# Altium schematic sheet ui_main.SchDoc: mcHF Pro Transceiver UI board
size A3; Author: Krassi Atanassov; CompanyName: MØNKA; Engineer: For radio amateurs experimentation, non-commercial use only. Thank you!; Revision: 0.8.5; SheetTotal: 13
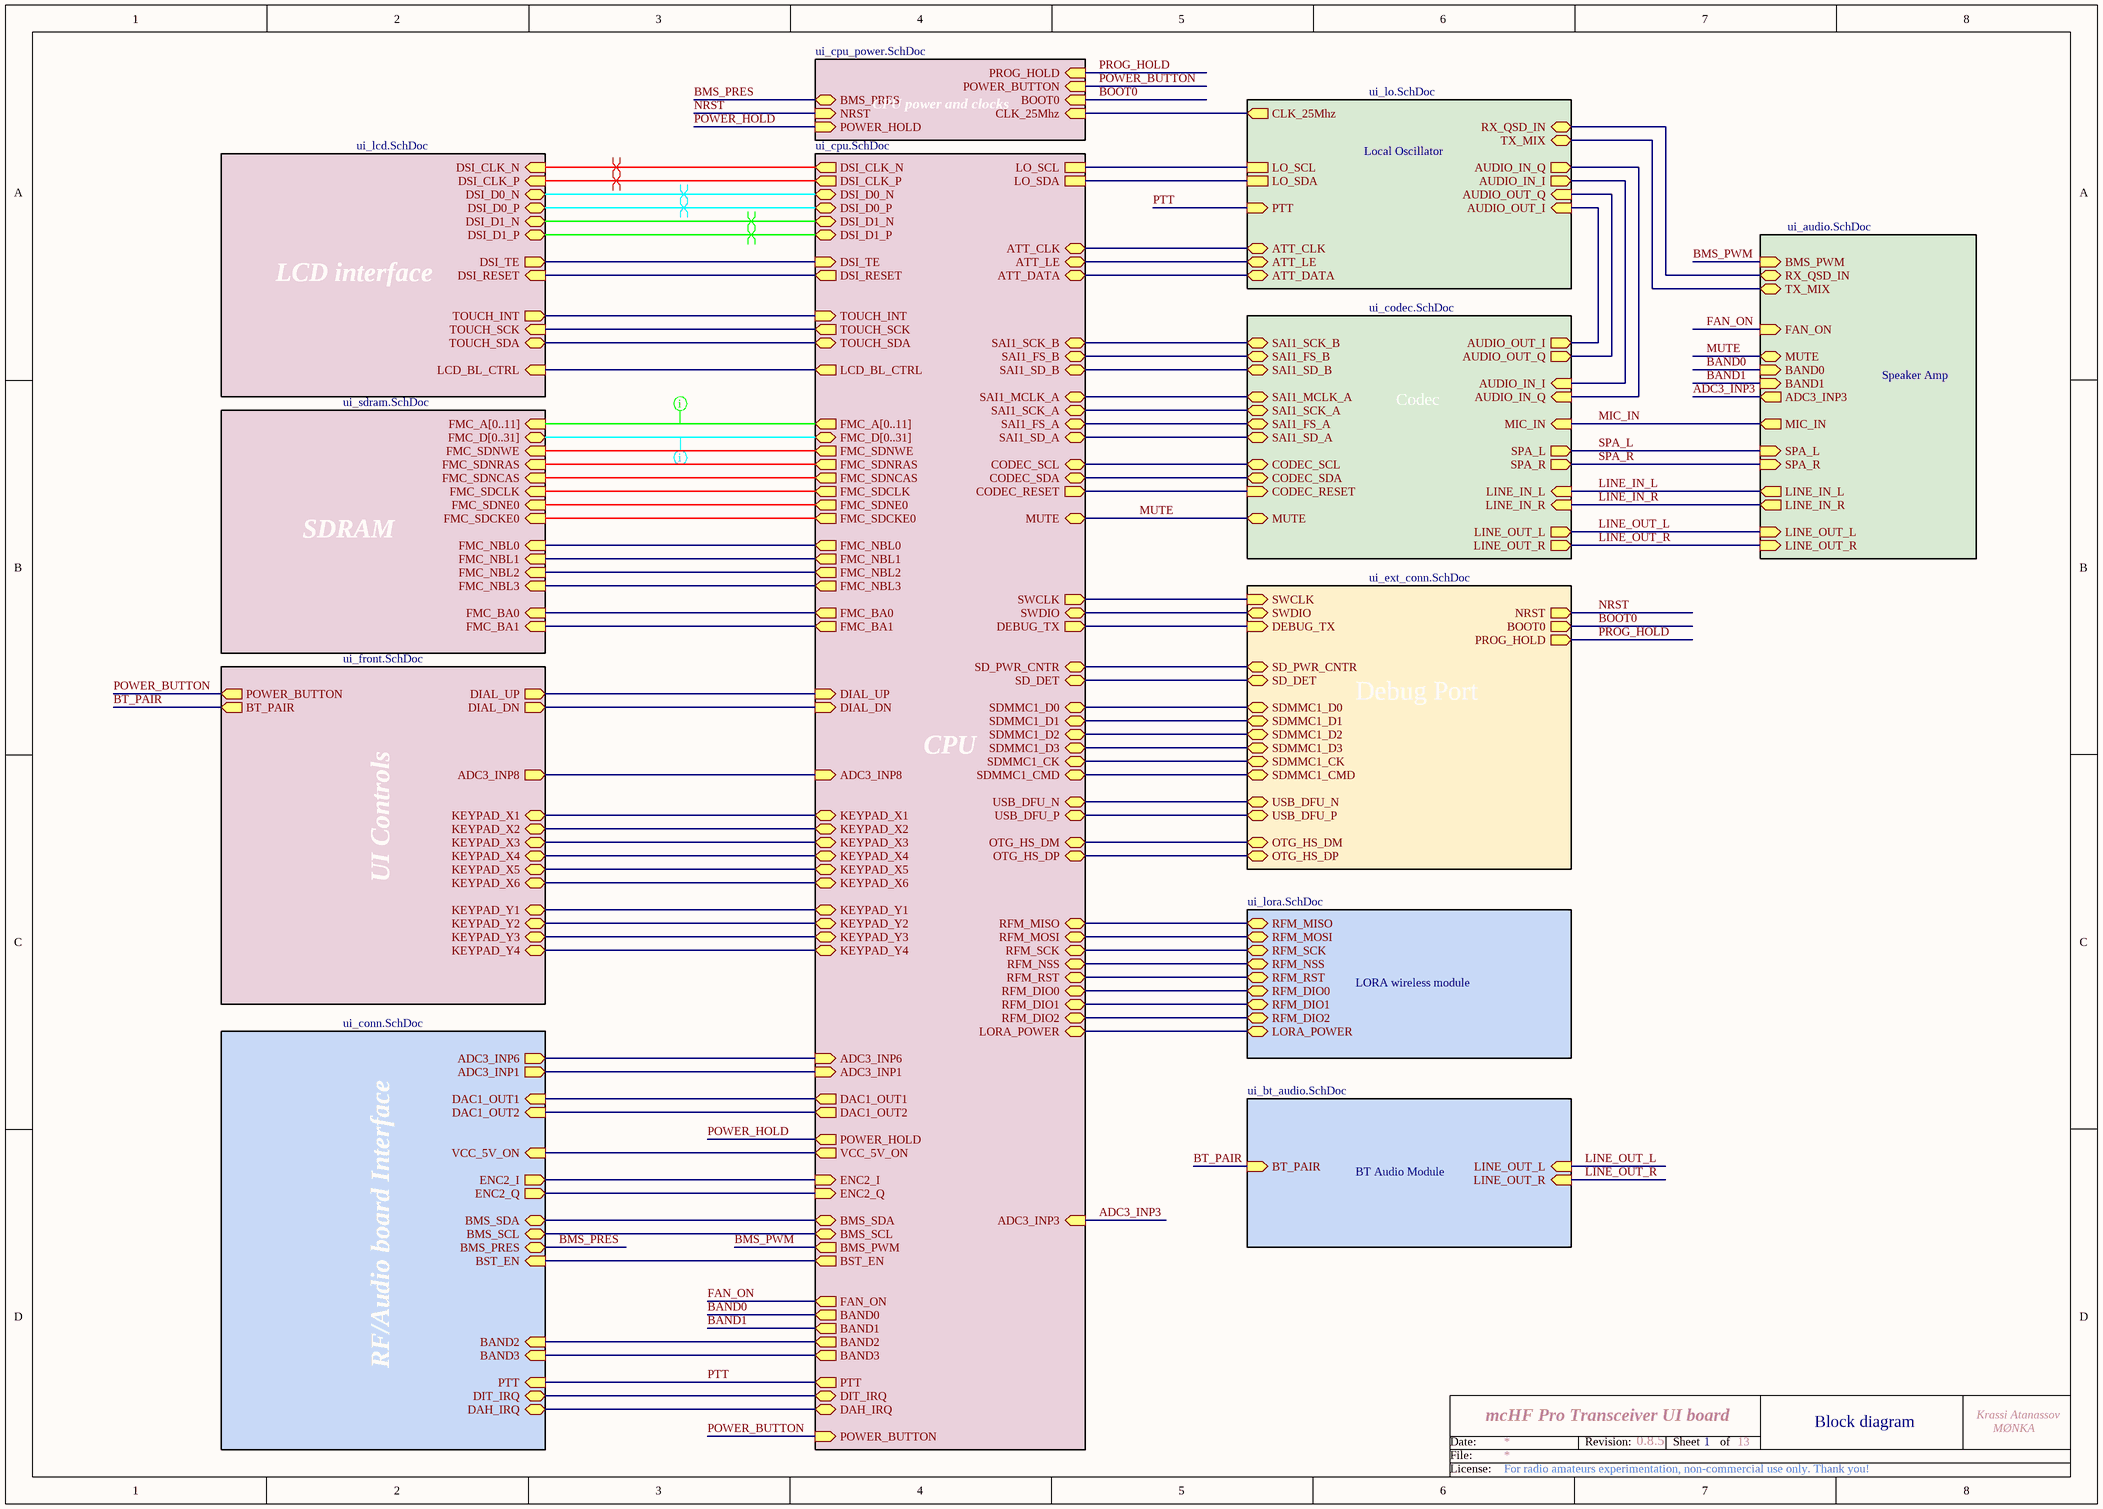
[diagram p0: ui_main.SchDoc]

## Sub-sheets
BT Audio Module = ui_bt_audio.SchDoc: BT_PAIR (in), LINE_OUT_L (in), LINE_OUT_R (in)
Codec = ui_codec.SchDoc: CODEC_SCL (bidir), CODEC_RESET (in), CODEC_SDA (bidir), AUDIO_OUT_I (out), AUDIO_OUT_Q (out), AUDIO_IN_I (in), AUDIO_IN_Q (in), MIC_IN (in), SPA_L (out), MUTE (bidir), LINE_IN_L (in), LINE_IN_R (in), LINE_OUT_L (out), LINE_OUT_R (out), SPA_R (out), SAI1_SCK_B (bidir), SAI1_FS_B (bidir), SAI1_SD_B (bidir), SAI1_MCLK_A (bidir), SAI1_SCK_A (bidir), SAI1_FS_A (bidir), SAI1_SD_A (bidir)
CPU = ui_cpu.SchDoc: FMC_A[0..11] (out), FMC_D[0..31] (bidir), FMC_SDNWE (out), FMC_SDNRAS (out), FMC_SDNCAS (out), FMC_SDCLK (out), FMC_BA0 (out), FMC_BA1 (out), FMC_SDNE0 (out), FMC_SDCKE0 (out), FMC_NBL0 (out), FMC_NBL1 (out), DIAL_UP (in), DIAL_DN (in), FMC_NBL2 (out), FMC_NBL3 (out), SWCLK (out), SWDIO (bidir), SDMMC1_D0 (bidir), SDMMC1_D1 (bidir), SDMMC1_D2 (bidir), SDMMC1_D3 (bidir), SDMMC1_CK (bidir), SDMMC1_CMD (bidir), RFM_DIO0 (bidir), RFM_DIO1 (bidir), RFM_DIO2 (bidir), LORA_POWER (bidir), DSI_CLK_N (out), DSI_CLK_P (out), DSI_D0_N (bidir), DSI_D0_P (bidir), DSI_D1_N (bidir), DSI_D1_P (bidir), LCD_BL_CTRL (out), TOUCH_INT (in), TOUCH_SCK (out), TOUCH_SDA (bidir), DSI_TE (in), DSI_RESET (out), LO_SCL, LO_SDA, KEYPAD_X2 (bidir), KEYPAD_X4 (bidir), KEYPAD_X3 (bidir), KEYPAD_X5 (bidir), KEYPAD_X6 (bidir), KEYPAD_Y1 (bidir), KEYPAD_Y2 (bidir), KEYPAD_Y3 (bidir), ADC3_INP6 (in), KEYPAD_Y4 (bidir), ADC3_INP1 (in), POWER_HOLD (out), DAC1_OUT1 (out), DAC1_OUT2 (out), KEYPAD_X1 (bidir), CODEC_SCL (bidir), CODEC_SDA (bidir), SAI1_SCK_B (bidir), SAI1_FS_B (bidir), SAI1_SD_B (bidir), SAI1_MCLK_A (bidir), SAI1_SCK_A (bidir), SAI1_FS_A (bidir), SAI1_SD_A (bidir), DEBUG_TX (out), VCC_5V_ON (out), RFM_MISO (bidir), RFM_MOSI (bidir), RFM_NSS (bidir), BAND0 (out), BAND1 (out), BAND2 (out), BAND3 (out), PTT (out), DIT_IRQ (bidir), DAH_IRQ (bidir), ADC3_INP8 (in), USB_DFU_N (bidir), USB_DFU_P (bidir), CODEC_RESET (out), POWER_BUTTON (in), MUTE (bidir), RFM_SCK (bidir), SD_DET (bidir), SD_PWR_CNTR (bidir), OTG_HS_DM (bidir), OTG_HS_DP (bidir), RFM_RST (bidir), BMS_SDA (bidir), BMS_SCL (bidir), ENC2_I (in), ENC2_Q (in), FAN_ON (out), ATT_CLK (bidir), ATT_LE (bidir), ATT_DATA (bidir), ADC3_INP3 (in), BMS_PWM (out), BST_EN (out)
CPU power and clocks = ui_cpu_power.SchDoc: NRST (in), CLK_25Mhz (in), POWER_HOLD (in), POWER_BUTTON (in), BOOT0 (in), BMS_PRES (bidir), PROG_HOLD (in)
Debug Port = ui_ext_conn.SchDoc: SWCLK (in), SWDIO (bidir), NRST (out), SD_PWR_CNTR (bidir), SD_DET (bidir), DEBUG_TX (in), USB_DFU_N (bidir), USB_DFU_P (bidir), SDMMC1_D0 (bidir), SDMMC1_D1 (bidir), SDMMC1_D2 (bidir), SDMMC1_D3 (bidir), SDMMC1_CK (bidir), SDMMC1_CMD (bidir), OTG_HS_DM (bidir), OTG_HS_DP (bidir), BOOT0 (out), PROG_HOLD (out)
LCD interface = ui_lcd.SchDoc: DSI_CLK_N (in), LCD_BL_CTRL (in), TOUCH_INT (out), TOUCH_SCK (in), TOUCH_SDA (bidir), DSI_CLK_P (in), DSI_D0_N (bidir), DSI_D0_P (bidir), DSI_D1_N (bidir), DSI_D1_P (bidir), DSI_TE (out), DSI_RESET (in)
Local Oscillator = ui_lo.SchDoc: LO_SCL, LO_SDA, CLK_25Mhz (out), AUDIO_OUT_I (in), AUDIO_OUT_Q (in), AUDIO_IN_I (out), AUDIO_IN_Q (out), TX_MIX (bidir), RX_QSD_IN (bidir), PTT (in), ATT_CLK (bidir), ATT_LE (bidir), ATT_DATA (bidir)
LORA wireless module = ui_lora.SchDoc: RFM_MISO (bidir), RFM_MOSI (bidir), RFM_SCK (bidir), RFM_NSS (bidir), RFM_RST (bidir), RFM_DIO0 (bidir), LORA_POWER (bidir), RFM_DIO1 (bidir), RFM_DIO2 (bidir)
RF/Audio board Interface = ui_conn.SchDoc: ADC3_INP6 (out), ADC3_INP1 (out), DAC1_OUT1 (in), DAC1_OUT2 (in), VCC_5V_ON (in), BAND2 (in), BAND3 (in), PTT (in), DIT_IRQ (bidir), DAH_IRQ (bidir), BMS_SDA (bidir), BMS_SCL (bidir), BMS_PRES (bidir), ENC2_I (out), ENC2_Q (out), BST_EN (in)
SDRAM = ui_sdram.SchDoc: FMC_A[0..11] (in), FMC_D[0..31] (bidir), FMC_SDNWE (in), FMC_SDNRAS (in), FMC_SDNCAS (in), FMC_SDCLK (in), FMC_BA0 (in), FMC_BA1 (in), FMC_NBL0 (in), FMC_NBL1 (in), FMC_SDNE0 (in), FMC_SDCKE0 (in), FMC_NBL2 (in), FMC_NBL3 (in)
Speaker Amp = ui_audio.SchDoc: MIC_IN (out), SPA_L (in), MUTE (bidir), LINE_IN_L (out), LINE_IN_R (out), LINE_OUT_L (in), LINE_OUT_R (in), SPA_R (in), BMS_PWM (in), TX_MIX (bidir), RX_QSD_IN (bidir), BAND0 (in), BAND1 (in), FAN_ON (in), ADC3_INP3 (out)
UI Controls = ui_front.SchDoc: KEYPAD_X1 (bidir), KEYPAD_X2 (bidir), KEYPAD_X3 (bidir), KEYPAD_X4 (bidir), KEYPAD_X5 (bidir), KEYPAD_X6 (bidir), KEYPAD_Y1 (bidir), KEYPAD_Y2 (bidir), KEYPAD_Y3 (bidir), KEYPAD_Y4 (bidir), DIAL_UP (out), DIAL_DN (out), POWER_BUTTON (out), ADC3_INP8 (out), BT_PAIR (out)

## Nets
ADC3_INP3: sheet CPU/ADC3_INP3, sheet Speaker Amp/ADC3_INP3
BAND0: sheet CPU/BAND0, sheet Speaker Amp/BAND0
BAND1: sheet CPU/BAND1, sheet Speaker Amp/BAND1
BMS_PRES: sheet RF/Audio board Interface/BMS_PRES, sheet CPU power and clocks/BMS_PRES
BMS_PWM: sheet CPU/BMS_PWM, sheet Speaker Amp/BMS_PWM
BOOT0: sheet CPU power and clocks/BOOT0, sheet Debug Port/BOOT0
BT_PAIR: sheet UI Controls/BT_PAIR, sheet BT Audio Module/BT_PAIR
FAN_ON: sheet CPU/FAN_ON, sheet Speaker Amp/FAN_ON
LINE_IN_L: sheet Codec/LINE_IN_L, sheet Speaker Amp/LINE_IN_L
LINE_IN_R: sheet Codec/LINE_IN_R, sheet Speaker Amp/LINE_IN_R
LINE_OUT_L: sheet Codec/LINE_OUT_L, sheet Speaker Amp/LINE_OUT_L, sheet BT Audio Module/LINE_OUT_L
LINE_OUT_R: sheet Codec/LINE_OUT_R, sheet Speaker Amp/LINE_OUT_R, sheet BT Audio Module/LINE_OUT_R
MIC_IN: sheet Codec/MIC_IN, sheet Speaker Amp/MIC_IN
MUTE: sheet CPU/MUTE, sheet Codec/MUTE, sheet Speaker Amp/MUTE
NRST: sheet CPU power and clocks/NRST, sheet Debug Port/NRST
POWER_BUTTON: sheet UI Controls/POWER_BUTTON, sheet CPU/POWER_BUTTON, sheet CPU power and clocks/POWER_BUTTON
POWER_HOLD: sheet CPU/POWER_HOLD, sheet CPU power and clocks/POWER_HOLD
PROG_HOLD: sheet CPU power and clocks/PROG_HOLD, sheet Debug Port/PROG_HOLD
PTT: sheet RF/Audio board Interface/PTT, sheet CPU/PTT, sheet Local Oscillator/PTT
SPA_L: sheet Codec/SPA_L, sheet Speaker Amp/SPA_L
SPA_R: sheet Codec/SPA_R, sheet Speaker Amp/SPA_R
(unnamed): sheet UI Controls/KEYPAD_X1, sheet CPU/KEYPAD_X1
(unnamed): sheet UI Controls/KEYPAD_X2, sheet CPU/KEYPAD_X2
(unnamed): sheet UI Controls/KEYPAD_X3, sheet CPU/KEYPAD_X3
(unnamed): sheet UI Controls/KEYPAD_X4, sheet CPU/KEYPAD_X4
(unnamed): sheet UI Controls/KEYPAD_X5, sheet CPU/KEYPAD_X5
(unnamed): sheet UI Controls/KEYPAD_X6, sheet CPU/KEYPAD_X6
(unnamed): sheet UI Controls/KEYPAD_Y1, sheet CPU/KEYPAD_Y1
(unnamed): sheet UI Controls/KEYPAD_Y2, sheet CPU/KEYPAD_Y2
(unnamed): sheet UI Controls/KEYPAD_Y3, sheet CPU/KEYPAD_Y3
(unnamed): sheet UI Controls/KEYPAD_Y4, sheet CPU/KEYPAD_Y4
(unnamed): sheet UI Controls/DIAL_UP, sheet CPU/DIAL_UP
(unnamed): sheet UI Controls/DIAL_DN, sheet CPU/DIAL_DN
(unnamed): sheet UI Controls/ADC3_INP8, sheet CPU/ADC3_INP8
(unnamed): sheet RF/Audio board Interface/ADC3_INP6, sheet CPU/ADC3_INP6
(unnamed): sheet RF/Audio board Interface/ADC3_INP1, sheet CPU/ADC3_INP1
(unnamed): sheet RF/Audio board Interface/DAC1_OUT1, sheet CPU/DAC1_OUT1
(unnamed): sheet RF/Audio board Interface/DAC1_OUT2, sheet CPU/DAC1_OUT2
(unnamed): sheet RF/Audio board Interface/VCC_5V_ON, sheet CPU/VCC_5V_ON
(unnamed): sheet RF/Audio board Interface/BAND2, sheet CPU/BAND2
(unnamed): sheet RF/Audio board Interface/BAND3, sheet CPU/BAND3
(unnamed): sheet RF/Audio board Interface/DIT_IRQ, sheet CPU/DIT_IRQ
(unnamed): sheet RF/Audio board Interface/DAH_IRQ, sheet CPU/DAH_IRQ
(unnamed): sheet RF/Audio board Interface/BMS_SDA, sheet CPU/BMS_SDA
(unnamed): sheet RF/Audio board Interface/BMS_SCL, sheet CPU/BMS_SCL
(unnamed): sheet RF/Audio board Interface/ENC2_I, sheet CPU/ENC2_I
(unnamed): sheet RF/Audio board Interface/ENC2_Q, sheet CPU/ENC2_Q
(unnamed): sheet RF/Audio board Interface/BST_EN, sheet CPU/BST_EN
(unnamed): sheet CPU/FMC_SDNWE, sheet SDRAM/FMC_SDNWE
(unnamed): sheet CPU/FMC_SDNRAS, sheet SDRAM/FMC_SDNRAS
(unnamed): sheet CPU/FMC_SDNCAS, sheet SDRAM/FMC_SDNCAS
(unnamed): sheet CPU/FMC_SDCLK, sheet SDRAM/FMC_SDCLK
(unnamed): sheet CPU/FMC_BA0, sheet SDRAM/FMC_BA0
(unnamed): sheet CPU/FMC_BA1, sheet SDRAM/FMC_BA1
(unnamed): sheet CPU/FMC_SDNE0, sheet SDRAM/FMC_SDNE0
(unnamed): sheet CPU/FMC_SDCKE0, sheet SDRAM/FMC_SDCKE0
(unnamed): sheet CPU/FMC_NBL0, sheet SDRAM/FMC_NBL0
(unnamed): sheet CPU/FMC_NBL1, sheet SDRAM/FMC_NBL1
(unnamed): sheet CPU/FMC_NBL2, sheet SDRAM/FMC_NBL2
(unnamed): sheet CPU/FMC_NBL3, sheet SDRAM/FMC_NBL3
(unnamed): sheet CPU/SWCLK, sheet Debug Port/SWCLK
(unnamed): sheet CPU/SWDIO, sheet Debug Port/SWDIO
(unnamed): sheet CPU/SDMMC1_D0, sheet Debug Port/SDMMC1_D0
(unnamed): sheet CPU/SDMMC1_D1, sheet Debug Port/SDMMC1_D1
(unnamed): sheet CPU/SDMMC1_D2, sheet Debug Port/SDMMC1_D2
(unnamed): sheet CPU/SDMMC1_D3, sheet Debug Port/SDMMC1_D3
(unnamed): sheet CPU/SDMMC1_CK, sheet Debug Port/SDMMC1_CK
(unnamed): sheet CPU/SDMMC1_CMD, sheet Debug Port/SDMMC1_CMD
(unnamed): sheet CPU/RFM_DIO0, sheet LORA wireless module/RFM_DIO0
(unnamed): sheet CPU/RFM_DIO1, sheet LORA wireless module/RFM_DIO1
(unnamed): sheet CPU/RFM_DIO2, sheet LORA wireless module/RFM_DIO2
(unnamed): sheet CPU/LORA_POWER, sheet LORA wireless module/LORA_POWER
(unnamed): sheet CPU/DSI_CLK_N, sheet LCD interface/DSI_CLK_N
(unnamed): sheet CPU/DSI_CLK_P, sheet LCD interface/DSI_CLK_P
(unnamed): sheet CPU/DSI_D0_N, sheet LCD interface/DSI_D0_N
(unnamed): sheet CPU/DSI_D0_P, sheet LCD interface/DSI_D0_P
(unnamed): sheet CPU/DSI_D1_N, sheet LCD interface/DSI_D1_N
(unnamed): sheet CPU/DSI_D1_P, sheet LCD interface/DSI_D1_P
(unnamed): sheet CPU/LCD_BL_CTRL, sheet LCD interface/LCD_BL_CTRL
(unnamed): sheet CPU/TOUCH_INT, sheet LCD interface/TOUCH_INT
(unnamed): sheet CPU/TOUCH_SCK, sheet LCD interface/TOUCH_SCK
(unnamed): sheet CPU/TOUCH_SDA, sheet LCD interface/TOUCH_SDA
(unnamed): sheet CPU/DSI_TE, sheet LCD interface/DSI_TE
(unnamed): sheet CPU/DSI_RESET, sheet LCD interface/DSI_RESET
(unnamed): sheet CPU/LO_SCL, sheet Local Oscillator/LO_SCL
(unnamed): sheet CPU/LO_SDA, sheet Local Oscillator/LO_SDA
(unnamed): sheet CPU/CODEC_SCL, sheet Codec/CODEC_SCL
(unnamed): sheet CPU/CODEC_SDA, sheet Codec/CODEC_SDA
(unnamed): sheet CPU/SAI1_SCK_B, sheet Codec/SAI1_SCK_B
(unnamed): sheet CPU/SAI1_FS_B, sheet Codec/SAI1_FS_B
(unnamed): sheet CPU/SAI1_SD_B, sheet Codec/SAI1_SD_B
(unnamed): sheet CPU/SAI1_MCLK_A, sheet Codec/SAI1_MCLK_A
(unnamed): sheet CPU/SAI1_SCK_A, sheet Codec/SAI1_SCK_A
(unnamed): sheet CPU/SAI1_FS_A, sheet Codec/SAI1_FS_A
(unnamed): sheet CPU/SAI1_SD_A, sheet Codec/SAI1_SD_A
(unnamed): sheet CPU/DEBUG_TX, sheet Debug Port/DEBUG_TX
(unnamed): sheet CPU/RFM_MISO, sheet LORA wireless module/RFM_MISO
(unnamed): sheet CPU/RFM_MOSI, sheet LORA wireless module/RFM_MOSI
(unnamed): sheet CPU/RFM_NSS, sheet LORA wireless module/RFM_NSS
(unnamed): sheet CPU/USB_DFU_N, sheet Debug Port/USB_DFU_N
(unnamed): sheet CPU/USB_DFU_P, sheet Debug Port/USB_DFU_P
(unnamed): sheet CPU/CODEC_RESET, sheet Codec/CODEC_RESET
(unnamed): sheet CPU/RFM_SCK, sheet LORA wireless module/RFM_SCK
(unnamed): sheet CPU/SD_DET, sheet Debug Port/SD_DET
(unnamed): sheet CPU/SD_PWR_CNTR, sheet Debug Port/SD_PWR_CNTR
(unnamed): sheet CPU/OTG_HS_DM, sheet Debug Port/OTG_HS_DM
(unnamed): sheet CPU/OTG_HS_DP, sheet Debug Port/OTG_HS_DP
(unnamed): sheet CPU/RFM_RST, sheet LORA wireless module/RFM_RST
(unnamed): sheet CPU/ATT_CLK, sheet Local Oscillator/ATT_CLK
(unnamed): sheet CPU/ATT_LE, sheet Local Oscillator/ATT_LE
(unnamed): sheet CPU/ATT_DATA, sheet Local Oscillator/ATT_DATA
(unnamed): sheet CPU power and clocks/CLK_25Mhz, sheet Local Oscillator/CLK_25Mhz
(unnamed): sheet Local Oscillator/AUDIO_OUT_I, sheet Codec/AUDIO_OUT_I
(unnamed): sheet Local Oscillator/AUDIO_OUT_Q, sheet Codec/AUDIO_OUT_Q
(unnamed): sheet Local Oscillator/AUDIO_IN_I, sheet Codec/AUDIO_IN_I
(unnamed): sheet Local Oscillator/AUDIO_IN_Q, sheet Codec/AUDIO_IN_Q
(unnamed): sheet Local Oscillator/TX_MIX, sheet Speaker Amp/TX_MIX
(unnamed): sheet Local Oscillator/RX_QSD_IN, sheet Speaker Amp/RX_QSD_IN

## Buses and harness runs
bus sheet CPU/FMC_A[0..11] = sheet SDRAM/FMC_A[0..11]
bus sheet CPU/FMC_D[0..31] = sheet SDRAM/FMC_D[0..31]

## Layout directives
differential pair: (no net found under the mark)
rule Matched Net Lengths [Tolerance = 100mil]: (no net found under the mark)

## Notes on the sheet
- 1
- Block diagram
- Date:
- File:
- Revision:
- Sheet
- of
- License: